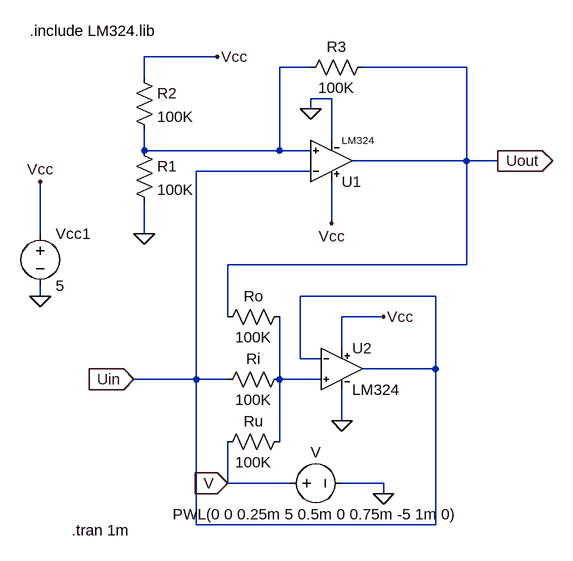
[diagram p0: schematic lab2_d.asc]
lab2_d.asc, the LTspice schematic file:
Version 4.1
SHEET 1 880 680
WIRE 64 -240 -48 -240
WIRE 208 -224 160 -224
WIRE 448 -224 288 -224
WIRE -48 -208 -48 -240
WIRE 240 -176 208 -176
WIRE 208 -160 208 -176
WIRE 240 -112 240 -176
WIRE -48 -96 -48 -128
WIRE 160 -96 160 -224
WIRE 160 -96 -48 -96
WIRE 208 -96 160 -96
WIRE 448 -80 448 -224
WIRE 448 -80 272 -80
WIRE 496 -80 448 -80
WIRE 208 -64 32 -64
WIRE 240 16 240 -48
WIRE -208 32 -208 -48
WIRE -48 32 -48 -16
WIRE 448 80 448 -80
WIRE 448 80 80 80
WIRE -208 128 -208 112
WIRE 400 128 192 128
WIRE 80 160 80 80
WIRE 320 160 256 160
WIRE 256 208 256 160
WIRE 192 224 192 128
WIRE 224 224 192 224
WIRE 400 240 400 128
WIRE 400 240 288 240
WIRE 32 256 32 -64
WIRE 32 256 -64 256
WIRE 80 256 32 256
WIRE 160 256 160 160
WIRE 224 256 160 256
WIRE 256 320 256 272
WIRE 160 352 160 256
WIRE 80 416 80 352
WIRE 176 416 80 416
WIRE 320 416 256 416
WIRE 320 432 320 416
WIRE 32 480 32 256
WIRE 400 480 400 240
WIRE 400 480 32 480
FLAG 256 320 0
FLAG 208 -160 0
FLAG -208 128 0
FLAG -48 32 0
FLAG 320 432 0
FLAG -64 256 Uin
IOPIN -64 256 In
FLAG 496 -80 Uout
IOPIN 496 -80 Out
FLAG 80 416 V
IOPIN 80 416 In
FLAG -208 -48 Vcc
FLAG 240 16 Vcc
FLAG 320 160 Vcc
FLAG 64 -240 Vcc
SYMBOL LM324 240 -80 M180
WINDOW 3 16 32 Left 1
SYMATTR InstName U1
SYMBOL LM324 256 240 R0
SYMATTR InstName U2
SYMBOL res 176 240 R90
WINDOW 0 0 56 VBottom 2
WINDOW 3 32 56 VTop 2
SYMATTR InstName Ri
SYMATTR Value 100K
SYMBOL res 176 144 R90
WINDOW 0 0 56 VBottom 2
WINDOW 3 32 56 VTop 2
SYMATTR InstName Ro
SYMATTR Value 100K
SYMBOL res 176 336 R90
WINDOW 0 0 56 VBottom 2
WINDOW 3 32 56 VTop 2
SYMATTR InstName Ru
SYMATTR Value 100K
SYMBOL res 304 -240 R90
WINDOW 0 0 56 VBottom 2
WINDOW 3 32 56 VTop 2
SYMATTR InstName R3
SYMATTR Value 100K
SYMBOL res -64 -112 R0
SYMATTR InstName R1
SYMATTR Value 100K
SYMBOL res -64 -224 R0
SYMATTR InstName R2
SYMATTR Value 100K
SYMATTR SpiceLine tol=1 pwr=0.1
SYMBOL voltage -208 16 R0
WINDOW 123 0 0 Left 0
WINDOW 39 0 0 Left 0
SYMATTR InstName Vcc1
SYMATTR Value 5
SYMBOL voltage 160 416 R270
WINDOW 0 32 56 VTop 2
WINDOW 3 -32 56 VBottom 2
WINDOW 123 0 0 Left 0
WINDOW 39 0 0 Left 0
SYMATTR InstName V
SYMATTR Value PWL(0 0 0.25m 5 0.5m 0 0.75m -5 1m 0)
TEXT -160 488 Left 2 !.tran 1m
TEXT -224 -280 Left 2 !.include LM324.lib

The netlist it stands for:
* lab2_d.asc
X§U1 N001 Uin Vcc 0 Uout LM324  ; pins In+ In- V+ V- OUT
X§U2 N002 Uin Vcc 0 Uin LM324  ; pins In+ In- V+ V- OUT
Ri N002 Uin 100K
Ro N002 Uout 100K
Ru N002 V 100K
R3 Uout N001 100K
R1 N001 0 100K
R2 Vcc N001 100K tol=1 pwr=0.1
Vcc1 Vcc 0 5
V V 0 PWL(0 0 0.25m 5 0.5m 0 0.75m -5 1m 0)
.tran 1m
.include LM324.lib
.backanno
.end